# EAGLE schematic logger (EAGLE 6.2)
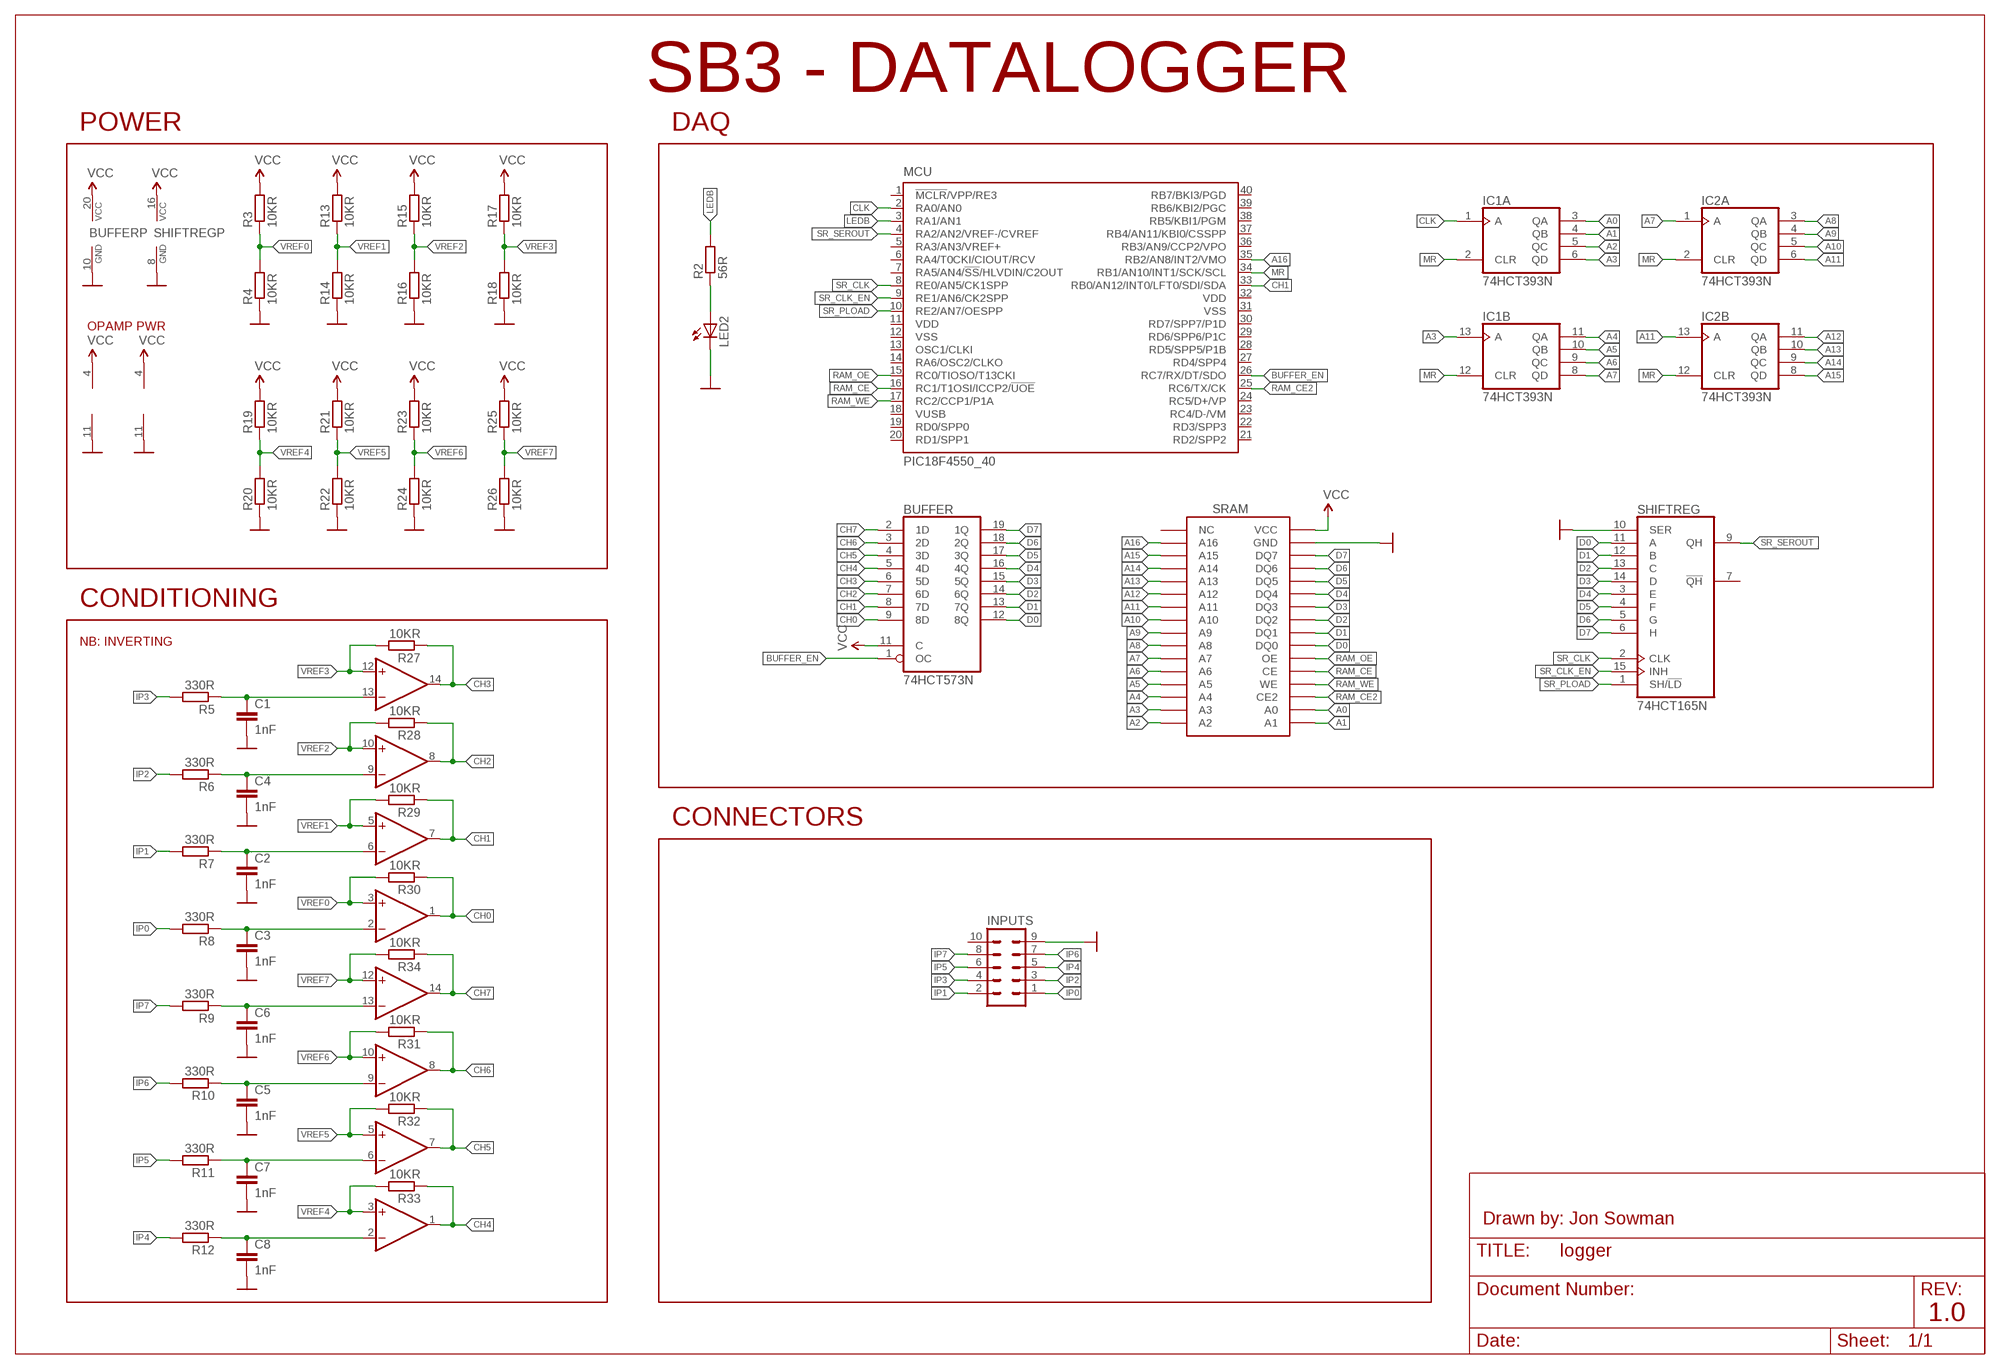
[diagram p0: schematic, sheet 1]

## Parts
BUFFER  74HCT573N  [DIL20]
C1  1nF  C-EU025_050-045X075  [C025_050-045X075]
C2  1nF  C-EU025_050-045X075  [C025_050-045X075]
C3  1nF  C-EU025_050-045X075  [C025_050-045X075]
C4  1nF  C-EU025_050-045X075  [C025_050-045X075]
C5  1nF  C-EU025_050-045X075  [C025_050-045X075]
C6  1nF  C-EU025_050-045X075  [C025_050-045X075]
C7  1nF  C-EU025_050-045X075  [C025_050-045X075]
C8  1nF  C-EU025_050-045X075  [C025_050-045X075]
IC1  74HCT393N  [DIL14]
IC2  74HCT393N  [DIL14]
INPUTS  MA05-2  [MA05-2]
LED2  LED5MM  [LED5MM]
MCU  PIC18F4550_40  [DIL40]
OPAMP1  LM2902N  [DIL14]
OPAMP2  LM2902N  [DIL14]
R2  56R  R-EU_0207/10  [0207/10]
R3  10KR  R-EU_0207/10  [0207/10]
R4  10KR  R-EU_0207/10  [0207/10]
R5  330R  R-EU_0207/10  [0207/10]
R6  330R  R-EU_0207/10  [0207/10]
R7  330R  R-EU_0207/10  [0207/10]
R8  330R  R-EU_0207/10  [0207/10]
R9  330R  R-EU_0207/10  [0207/10]
R10  330R  R-EU_0207/10  [0207/10]
R11  330R  R-EU_0207/10  [0207/10]
R12  330R  R-EU_0207/10  [0207/10]
R13  10KR  R-EU_0207/10  [0207/10]
R14  10KR  R-EU_0207/10  [0207/10]
R15  10KR  R-EU_0207/10  [0207/10]
R16  10KR  R-EU_0207/10  [0207/10]
R17  10KR  R-EU_0207/10  [0207/10]
R18  10KR  R-EU_0207/10  [0207/10]
R19  10KR  R-EU_0207/10  [0207/10]
R20  10KR  R-EU_0207/10  [0207/10]
R21  10KR  R-EU_0207/10  [0207/10]
R22  10KR  R-EU_0207/10  [0207/10]
R23  10KR  R-EU_0207/10  [0207/10]
R24  10KR  R-EU_0207/10  [0207/10]
R25  10KR  R-EU_0207/10  [0207/10]
R26  10KR  R-EU_0207/10  [0207/10]
R27  10KR  R-EU_0207/10  [0207/10]
R28  10KR  R-EU_0207/10  [0207/10]
R29  10KR  R-EU_0207/10  [0207/10]
R30  10KR  R-EU_0207/10  [0207/10]
R31  10KR  R-EU_0207/10  [0207/10]
R32  10KR  R-EU_0207/10  [0207/10]
R33  10KR  R-EU_0207/10  [0207/10]
R34  10KR  R-EU_0207/10  [0207/10]
SHIFTREG  74HCT165N  [DIL16]
SRAM  ALLIANCE-SRAM  [DIL32]

## Nets
A0: IC1.3(A:QA) SRAM.12(A0)
A1: IC1.4(A:QB) SRAM.11(A1)
A2: IC1.5(A:QC) SRAM.10(A2)
A3: IC1.6(A:QD) IC1.13(B:A) SRAM.9(A3)
A4: IC1.11(B:QA) SRAM.8(A4)
A5: IC1.10(B:QB) SRAM.7(A5)
A6: IC1.9(B:QC) SRAM.6(A6)
A7: IC1.8(B:QD) IC2.1(A:A) SRAM.5(A7)
A8: IC2.3(A:QA) SRAM.27(A8)
A9: IC2.4(A:QB) SRAM.26(A9)
A10: IC2.5(A:QC) SRAM.23(A10)
A11: IC2.6(A:QD) IC2.13(B:A) SRAM.25(A11)
A12: IC2.11(B:QA) SRAM.4(A12)
A13: IC2.10(B:QB) SRAM.28(A13)
A14: IC2.9(B:QC) SRAM.3(A14)
A15: IC2.8(B:QD) SRAM.31(A15)
A16: MCU.35(RB2/AN8/INT2/VMO) SRAM.2(A16)
BUFFER_EN: BUFFER.1(OC) MCU.26(RC7/RX/DT/SDO)
CH0: BUFFER.9(8D) OPAMP1.1(A:OUT) R30.1
CH1: BUFFER.8(7D) MCU.33(RB0/AN12/INT0/LFT0/SDI/SDA) OPAMP1.7(B:OUT) R29.1
CH2: BUFFER.7(6D) OPAMP1.8(C:OUT) R28.1
CH3: BUFFER.6(5D) OPAMP1.14(D:OUT) R27.1
CH4: BUFFER.5(4D) OPAMP2.1(A:OUT) R33.1
CH5: BUFFER.4(3D) OPAMP2.7(B:OUT) R32.1
CH6: BUFFER.3(2D) OPAMP2.8(C:OUT) R31.1
CH7: BUFFER.2(1D) OPAMP2.14(D:OUT) R34.1
CLK: IC1.1(A:A) MCU.2(RA0/AN0)
D0: BUFFER.12(8Q) SHIFTREG.11(A) SRAM.13(DQ0)
D1: BUFFER.13(7Q) SHIFTREG.12(B) SRAM.14(DQ1)
D2: BUFFER.14(6Q) SHIFTREG.13(C) SRAM.15(DQ2)
D3: BUFFER.15(5Q) SHIFTREG.14(D) SRAM.17(DQ3)
D4: BUFFER.16(4Q) SHIFTREG.3(E) SRAM.18(DQ4)
D5: BUFFER.17(3Q) SHIFTREG.4(F) SRAM.19(DQ5)
D6: BUFFER.18(2Q) SHIFTREG.5(G) SRAM.20(DQ6)
D7: BUFFER.19(1Q) SHIFTREG.6(H) SRAM.21(DQ7)
GND: BUFFER.10(GND) C1.2 C2.2 C3.2 C4.2 C5.2 C6.2 C7.2 C8.2 INPUTS.9 LED2.K(C) OPAMP1.11(P:V-) OPAMP2.11(P:V-) R4.1 R14.1 R16.1 R18.1 R20.1 R22.1 R24.1 R26.1 SHIFTREG.8(GND) SHIFTREG.10(SER) SRAM.16(GND)
IP0: INPUTS.1 R8.2
IP1: INPUTS.2 R7.2
IP2: INPUTS.3 R6.2
IP3: INPUTS.4 R5.2
IP4: INPUTS.5 R12.2
IP5: INPUTS.6 R11.2
IP6: INPUTS.7 R10.2
IP7: INPUTS.8 R9.2
LEDB: MCU.3(RA1/AN1) R2.2
MR: IC1.2(A:CLR) IC1.12(B:CLR) IC2.2(A:CLR) IC2.12(B:CLR) MCU.34(RB1/AN10/INT1/SCK/SCL)
N$1: C1.1 OPAMP1.13(D:-IN) R5.1
N$3: C4.1 OPAMP1.9(C:-IN) R6.1
N$4: LED2.A R2.1
N$5: C2.1 OPAMP1.6(B:-IN) R7.1
N$6: C3.1 OPAMP1.2(A:-IN) R8.1
N$7: C6.1 OPAMP2.13(D:-IN) R9.1
N$8: C5.1 OPAMP2.9(C:-IN) R10.1
N$9: C7.1 OPAMP2.6(B:-IN) R11.1
N$10: C8.1 OPAMP2.2(A:-IN) R12.1
RAM_CE: MCU.16(RC1/T1OSI/ICCP2/!UOE) SRAM.22(CE)
RAM_CE2: MCU.25(RC6/TX/CK) SRAM.30(CE2)
RAM_OE: MCU.15(RC0/TIOSO/T13CKI) SRAM.24(OE)
RAM_WE: MCU.17(RC2/CCP1/P1A) SRAM.29(WE)
SR_CLK: MCU.8(RE0/AN5/CK1SPP) SHIFTREG.2(CLK)
SR_CLK_EN: MCU.9(RE1/AN6/CK2SPP) SHIFTREG.15(INH)
SR_PLOAD: MCU.10(RE2/AN7/OESPP) SHIFTREG.1(SH/!LD)
SR_SEROUT: MCU.4(RA2/AN2/VREF-/CVREF) SHIFTREG.9(QH)
VCC: BUFFER.11(C) BUFFER.20(VCC) OPAMP1.4(P:V+) OPAMP2.4(P:V+) R3.2 R13.2 R15.2 R17.2 R19.2 R21.2 R23.2 R25.2 SHIFTREG.16(VCC) SRAM.32(VCC)
VREF0: OPAMP1.3(A:+IN) R3.1 R4.2 R30.2
VREF1: OPAMP1.5(B:+IN) R13.1 R14.2 R29.2
VREF2: OPAMP1.10(C:+IN) R15.1 R16.2 R28.2
VREF3: OPAMP1.12(D:+IN) R17.1 R18.2 R27.2
VREF4: OPAMP2.3(A:+IN) R19.1 R20.2 R33.2
VREF5: OPAMP2.5(B:+IN) R21.1 R22.2 R32.2
VREF6: OPAMP2.10(C:+IN) R23.1 R24.2 R31.2
VREF7: OPAMP2.12(D:+IN) R25.1 R26.2 R34.2
Unconnected: INPUTS.10 MCU.1(!MCLR!/VPP/RE3) MCU.5(RA3/AN3/VREF+) MCU.6(RA4/T0CKI/CIOUT/RCV) MCU.7(RA5/AN4/!SS!/HLVDIN/C2OUT) MCU.13(OSC1/CLKI) MCU.14(RA6/OSC2/CLKO) MCU.18(VUSB) MCU.19(RD0/SPP0) MCU.20(RD1/SPP1) MCU.21(RD2/SPP2) MCU.22(RD3/SPP3) MCU.23(RC4/D-/VM) MCU.24(RC5/D+/VP) MCU.27(RD4/SPP4) MCU.28(RD5/SPP5/P1B) MCU.29(RD6/SPP6/P1C) MCU.30(RD7/SPP7/P1D) MCU.36(RB3/AN9/CCP2/VPO) MCU.37(RB4/AN11/KBI0/CSSPP) MCU.38(RB5/KBI1/PGM) MCU.39(RB6/KBI2/PGC) MCU.40(RB7/BKI3/PGD) SHIFTREG.7(!QH) SRAM.1(NC)

## Notes on the sheet
- SB3 - DATALOGGER
- POWER | DAQ
- OPAMP PWR
- CONDITIONING
- NB: INVERTING
- CONNECTORS
- Drawn by: Jon Sowman
- 1.0

## Power pins joined to a net without a drawn wire
GND: IC1.7(P:GND) IC2.7(P:GND)
VCC: IC1.14(P:VCC) IC2.14(P:VCC)
VDD: MCU.11(VDD) MCU.32(VDD)
VSS: MCU.12(VSS) MCU.31(VSS)

## Library data of the parts
BUFFER = 74xx-eu:74*573: 8-bit D latch BUS DRIVER
C1-C8 = rcl:C-EU: CAPACITOR, European symbol
IC1 IC2 = 74xx-eu:74*393: Dual 4-bit decade and binary COUNTER
INPUTS = con-lstb:MA05-2: PIN HEADER; OC_FARNELL: unknown; OC_NEWARK: unknown
LED2 = led:LED: LED OSRAM: - CHIPLED LG R971, LG N971, LY N971, LG Q971, LY Q971, LO R971, LY R971 LH N974, LH R974 LS Q976, LO Q976, LY Q976 LO Q996 - Hyper CHIPLED LW Q18S LB Q993, LB Q99A, LB R99A - SideLED LS A670, LO A670, LY A670, LG A670, LP A670 LB A673, LV A673, LT A673, LW A673 LH A674 LY A675 LS A676, LA A676, LO A676, LY A676, LW A676 LS A679, LY A679, LG A679 - Hyper Micro SIDELED® LS Y876, LA Y876, LO Y876, LY Y876 LT Y87S - SmartLED LW L88C, LW L88S LB L89C, LB L89S, LG L890 LS L89K, LO L89K, LY L89K LS L896, LA L896, LO L896, LY L896 - TOPLED LS T670, LO T670, LY T670, LG T670, LP T670 LSG T670, LSP T670, LSY T670, LOP T670, LYG T670 LG T671, LOG T671, LSG T671 LB T673, LV T673, LT T673, LW T673 LH T674 LS T676, LA T676, LO T676, LY T676, LB T676, LH T676, LSB T676, LW T676 LB T67C, LV T67C, LT T67C, LS T67K, LO T67K, LY T67K, LW E67C LS E67B, LA E67B, LO E67B, LY E67B, LB E67C, LV E67C, LT E67C LW T67C LS T679, LY T679, LG T679 LS T770, LO T770, LY T770, LG T770, LP T770 LB T773, LV T773, LT T773, LW T773 LH T774 LS E675, LA E675, LY E675, LS T675 LS T776, LA T776, LO T776, LY T776, LB T776 LHGB T686 LT T68C, LB T68C - Hyper Mini TOPLED® LB M676 - Mini TOPLED Santana® LG M470 LS M47K, LO M47K, LY M47K Source: http://www.osram.convergy.de LUXEON: - LUMILED® LXK2-PW12-R00, LXK2-PW12-S00, LXK2-PW14-U00, LXK2-PW14-V00 LXK2-PM12-R00, LXK2-PM12-S00, LXK2-PM14-U00 LXK2-PE12-Q00, LXK2-PE12-R00, LXK2-PE12-S00, LXK2-PE14-T00, LXK2-PE14-U00 LXK2-PB12-K00, LXK2-PB12-L00, LXK2-PB12-M00, LXK2-PB14-N00, LXK2-PB14-P00, LXK2-PB14-Q00 LXK2-PR12-L00, LXK2-PR12-M00, LXK2-PR14-Q00, LXK2-PR14-R00 LXK2-PD12-Q00, LXK2-PD12-R00, LXK2-PD12-S00 LXK2-PH12-R00, LXK2-PH12-S00 LXK2-PL12-P00, LXK2-PL12-Q00, LXK2-PL12-R00 Source: www.luxeon.com KINGBRIGHT: KA-3528ASYC Source: www.kingbright.com
MCU = microchip:PIC18F4*_40: USB Microcontrollers with nanoWatt Technology High-Performance, Enhanced Flash, 28/40/44-Pin, Source: http://ww1.microchip.com/downloads/en/devicedoc/39632c.pdf; MF: MICROCHIP; MPN: PIC18F4550-I/P; OC_FARNELL: 9321357; OC_NEWARK: 74K8623
OPAMP1 OPAMP2 = linear:LM2902: Low power quad operational amplifier Source: Data sgeet <http://www.st.com/internet/com/TECHNICAL_RESOURCES/TECHNICAL_LITERATURE/DATASHEET/CD00000533.pdf>
R2-R34 = rcl:R-EU_: RESISTOR, European symbol
SHIFTREG = 74xx-eu:74*165: 8-bit parallel load SHIFT REGISTER
SRAM = datalogger-sb3:ALLIANCE-SRAM